# Altium schematic sheet hometrainer.SchDoc
size 209 x 148 mm; DocumentNumber: 1; SheetNumber: 1; SheetTotal: 2
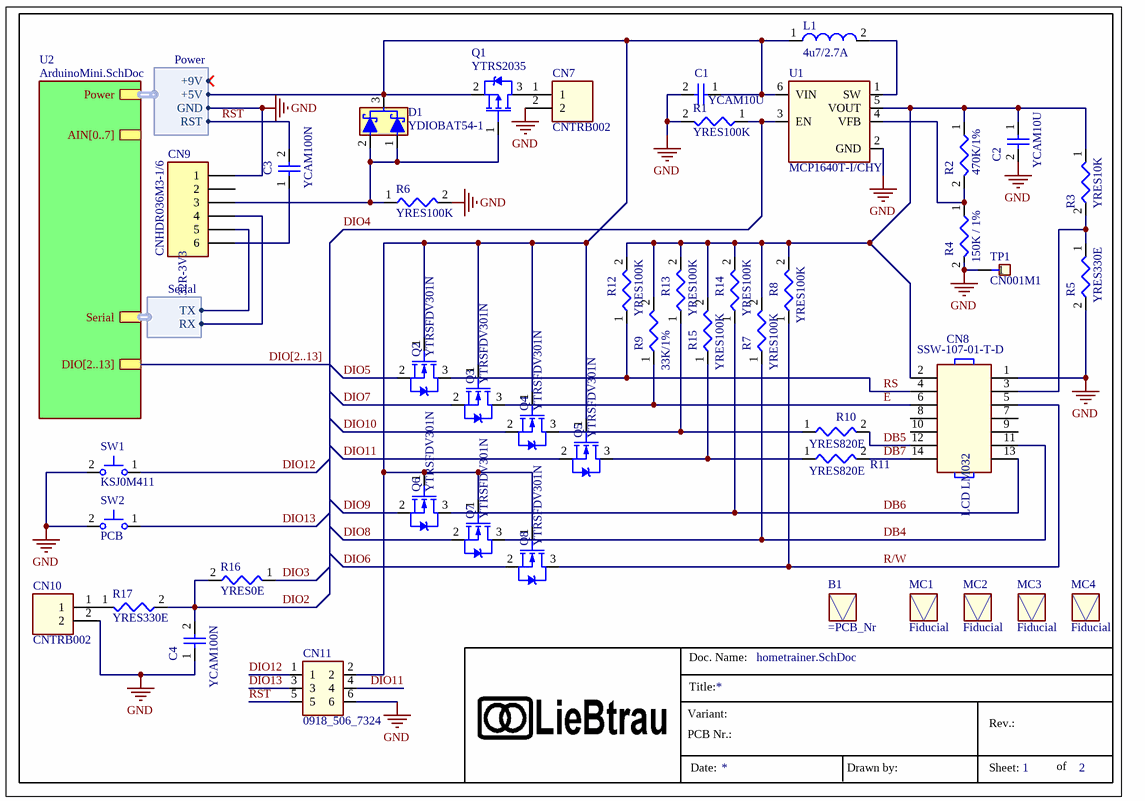
[diagram p0: hometrainer.SchDoc]

## Parts
B1  (no value)  [MC_BoardNr]
C1  YCAM10U  [CA_1206]
C2  YCAM10U  [CA_1206]
C3  YCAM100N  [CA_1206]
C4  YCAM100N  [CA_1206]
CN7  CNTRB002  [CN_MKDSN 1,5/2]
CN8  SSW-107-01-T-D  [CN_SCKT2X7]
CN9  CNHDR036M3-1/6  [CN_HDR1X6]
CN10  CNTRB002  [CN_MKDSN 1,5/2]
CN11  0918_506_7324  [CN_HARTING_918506X324]
D1  YDIOBAT54-1  [SC_SOT23]
L1  4u7/2.7A  [CL_STD_2220]
MC1  Fiducial  [MC_FIDUCIAL]  (no BOM)
MC2  Fiducial  [MC_FIDUCIAL]  (no BOM)
MC3  Fiducial  [MC_FIDUCIAL]  (no BOM)
MC4  Fiducial  [MC_FIDUCIAL]  (no BOM)
Q1  YTRS2035  [SC_SOT23]
Q2  YTRSFDV301N  [SC_SOT23]
Q3  YTRSFDV301N  [SC_SOT23]
Q4  YTRSFDV301N  [SC_SOT23]
Q5  YTRSFDV301N  [SC_SOT23]
Q6  YTRSFDV301N  [SC_SOT23]
Q7  YTRSFDV301N  [SC_SOT23]
Q8  YTRSFDV301N  [SC_SOT23]
R1  YRES100K  [RE_1206]
R2  470K/1%  [RE_1206]
R3  YRES10K  [RE_1206]
R4  150K / 1%  [RE_1206]
R5  YRES330E  [RE_1206]
R6  YRES100K  [RE_1206]
R7  YRES100K  [RE_1206]
R8  YRES100K  [RE_1206]
R9  33K/1%  [RE_1206]
R10  YRES820E  [RE_1206]
R11  YRES820E  [RE_1206]
R12  YRES100K  [RE_1206]
R13  YRES100K  [RE_1206]
R14  YRES100K  [RE_1206]
R15  YRES100K  [RE_1206]
R16  YRES0E  [RE_1206]
R17  YRES330E  [RE_1206]
SW1  KSJ0M411  [SW_KSJ-M]
SW2  PCB  [SW_PCB]
TP1  CN001M1  [CN_TP_TH_1.3mm]  (no BOM)
U1  MCP1640T-I/CHY  [SC_SOT23-6]

## Sub-sheets
U2 = ArduinoMini.SchDoc: Power (harness Power), Serial (harness Serial), DIO[2..13], AIN[0..7]

## Harnesses
Power: +9V, +5V, GND, RST
Serial: TX, RX

## Nets
GND: C1.2 C2.2 C4.1 CN7.2 CN8.1 CN9.1 CN10.2 CN11.6 R1.2 R4.2 R5.2 R6.2 SW1.2 SW2.2 TP1.1 U1.2(GND) ; sheet U2/Power.GND
DB4: CN8.11 Q7.3(D) R7.1
DB5: CN8.12 R10.2
DB6: CN8.13 Q6.3(D) R14.1
DB7: CN8.14 R11.2
DIO2: C4.2 R16.2 R17.2
DIO3: R16.1
DIO4: R1.1 U1.3(EN)
DIO5: Q2.2(S)
DIO6: Q8.2(S)
DIO7: Q3.2(S)
DIO8: Q7.2(S)
DIO9: Q6.2(S)
DIO10: Q4.2(S)
DIO11: CN11.4 Q5.2(S)
DIO12: CN11.1 SW1.1
DIO13: CN11.3 SW2.1
E: CN8.6 Q3.3(D) R9.1
R/W: CN8.5 Q8.3(D) R8.1
RS: CN8.4 Q2.3(D) R12.1
RST: C3.2 CN11.5 ; sheet U2/Power.RST
NetC1_1: C1.1 CN11.2 D1.3(C) L1.1 Q1.2(S) Q2.1(G) Q3.1(G) Q4.1(G) Q5.1(G) Q6.1(G) Q7.1(G) Q8.1(G) U1.6(VIN) ; sheet U2/Power.+5V
NetC2_1: C2.1 CN8.2 R2.1 R3.1 R7.2 R8.2 R9.2 R12.2 R13.2 R14.2 R15.2 U1.5(VOUT)
NetC3_1: C3.1 CN9.6
NetCN7_1: CN7.1 Q1.3(D)
NetCN8_3: CN8.3 R3.2 R5.1
NetCN9_3: CN9.3 D1.1(A1) D1.2(A2) Q1.1(G) R6.1
NetCN9_4: CN9.4 ; sheet U2/Serial.RX
NetCN9_5: CN9.5 ; sheet U2/Serial.TX
NetCN10_1: CN10.1 R17.1
NetL1_2: L1.2 U1.1(SW)
NetQ4_3: Q4.3(D) R10.1 R13.1
NetQ5_3: Q5.3(D) R11.1 R15.1
NetR2_2: R2.2 R4.1 U1.4(VFB)

Not connected (* = marked no-connect by the designer): CN8 7 8 9 10; CN9 2

## Buses and harness runs
bus DIO[2..13] = sheet U2/DIO[2..13]

## Notes on the sheet
- (near CN9) TTL-232R-3V3
- (near CN8) LCD LM032
- Title:
- Doc. Name:
- Variant:
- PCB Nr.:
- Rev.:
- Date:
- Drawn by:
- Sheet:
- of

## Library data of the parts
B1 = BARE_PCB: Part Number: BARE_PCB; Order Code: =PCB_Nr
C1 C2 = YCAM10U: Order Code: Farnell 1828807; Part Number: YCAM10U; Component Type: capacitor
C3 C4 = YCAM100N: Order Code: Farnell 1759361; Part Number: YCAM100N; Component Type: capacitor
CN8 = SSW-107-01-T-D: Manufacturer: Samtec; Order Code: Farnell 1803960; Part Number: SSW-107-01-T-D; Component Type: connector
CN9 = CNHDR036M3-1/6: *; Order Code: RS: 673-7474; Part Number: CNHDR036M3-1/6; Component Type: connector
CN11 = 0918_506_7324: Manufacturer: Harting; Order Code: Farnell 1096984; Part Number: 0918_506_7324; Component Type: connector
D1 = YDIOBAT54-1: Dual Schottky Barrier Diode Common Cathode; Manufacturer: Fairchild Semiconductor; Order Code: Farnell 1467518; Part Number: YDIOBAT54-1; Component Type: diode
L1 = LQH55DN4R7M03L: Manufacturer: Murata; Order Code: Farnell 1515511; Part Number: LQH55DN4R7M03L; Component Type: inductor
Q1 = YTRS2035: Manufacturer: Diodes Inc.; Order Code: Farnell 2061419; Part Number: YTRS2035; Component Type: pmos
Q2-Q8 = YTRSFDV301N: Manufacturer: FAIRCHILD SEMICONDUCTOR; Order Code: Farnell 9845011; Part Number: YTRSFDV301N; Component Type: nmos
R1 R6-R8 R12-R15 = YRES100K: Resistor; Manufacturer: Multicomp; Order Code: Farnell 2073879; Part Number: YRES100K; Component Type: resistor
R2 = CRCW1206470KFKEA: Resistor; Manufacturer: Vishay Draloric; Order Code: Farnell 2139655; Part Number: CRCW1206470KFKEA; Component Type: resistor
R3 = YRES10K: Resistor; Manufacturer: Vishay Draloric; Order Code: Farnell 1469970; Part Number: YRES10K; Component Type: resistor
R4 = RC1206FR-07150KL: Resistor; Manufacturer: Yageo (Phycomp); Order Code: Farnell 9241078/ 1100249; Part Number: RC1206FR-07150KL; Component Type: resistor
R5 R17 = YRES330E: Resistor; Manufacturer: Welwyn; Order Code: Farnell 1100177; Part Number: YRES330E; Component Type: resistor
R9 = MCMR12X3302FTL: Resistor; Manufacturer: Multicomp; Order Code: Farnell 2073920; Part Number: MCMR12X3302FTL; Component Type: resistor
R10 R11 = YRES820E: Resistor; Part Number: YRES820E; Component Type: resistor
R16 = YRES0E: Resistor; Manufacturer: Vishay Draloric; Order Code: Farnell 1469963; Part Number: YRES0E; Component Type: resistor
SW1 = KSJ0M411: Manufacturer: C&K; Order Code: RS: 102-383; Part Number: KSJ0M411; Component Type: switch
SW2 = PCB_SWITCH: Part Number: PCB_SWITCH; Component Type: switch
U1 = MCP1640T-I/CHY: Manufacturer: Microchip; Order Code: Farnell 1800205; Part Number: MCP1640T-I/CHY; Component Type: regulator
CN7 CN10 = CNTRB002: Part Number: CNTRB002; Component Type: connector
MC1-MC4 = Fiducial: Part Number: Fiducial
TP1 = CN001M1: Part Number: CN001M1; Component Type: testpin